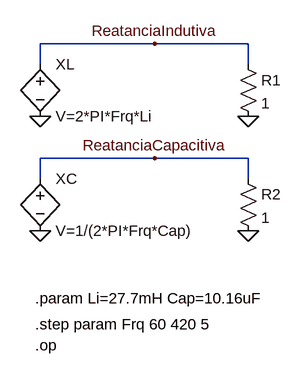
[diagram p0: schematic HarmonicFilterSigleTunedImpedances.asc]
HarmonicFilterSigleTunedImpedances.asc, the LTspice schematic file:
Version 4
SHEET 1 1224 680
WIRE 576 32 400 32
WIRE 720 32 576 32
WIRE 400 64 400 32
WIRE 720 64 720 32
WIRE 576 208 400 208
WIRE 720 208 576 208
WIRE 400 240 400 208
WIRE 720 240 720 208
FLAG 400 144 0
FLAG 720 144 0
FLAG 400 320 0
FLAG 720 320 0
FLAG 576 32 ReatanciaIndutiva
FLAG 576 208 ReatanciaCapacitiva
SYMBOL bv 400 48 R0
SYMATTR InstName XL
SYMATTR Value V=2*PI*Frq*Li
SYMBOL res 704 48 R0
SYMATTR InstName R1
SYMATTR Value 1
SYMBOL bv 400 224 R0
SYMATTR InstName XC
SYMATTR Value V=1/(2*PI*Frq*Cap)
SYMBOL res 704 224 R0
SYMATTR InstName R2
SYMATTR Value 1
TEXT 392 424 Left 2 !.param Li=27.7mH Cap=10.16uF
TEXT 392 464 Left 2 !.step param Frq 60 420 5
TEXT 392 496 Left 2 !.op

The netlist it stands for:
* HarmonicFilterSigleTunedImpedances.asc
B§XL ReatanciaIndutiva 0 V=2*PI*Frq*Li
R1 ReatanciaIndutiva 0 1
B§XC ReatanciaCapacitiva 0 V=1/(2*PI*Frq*Cap)
R2 ReatanciaCapacitiva 0 1
.param Li=27.7mH Cap=10.16uF
.step param Frq 60 420 5
.op
.backanno
.end